# EAGLE design satellitev2 (EAGLE 6.4)
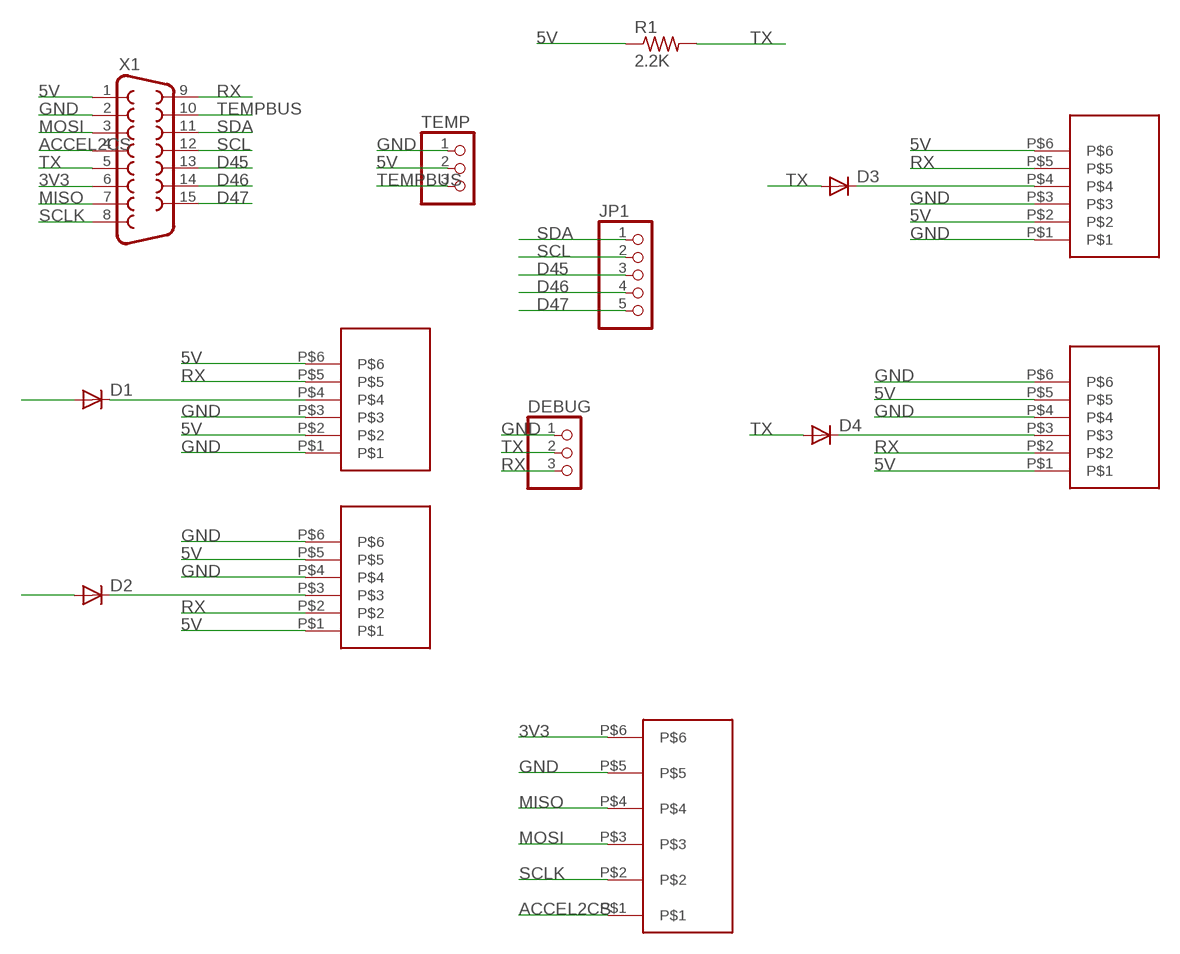
[diagram p0: schematic, sheet 1]

## Parts
D1  DIODEPTH  [DIODE-1N4001]
D2  DIODEPTH  [DIODE-1N4001]
D3  DIODEPTH  [DIODE-1N4001]
D4  DIODEPTH  [DIODE-1N4001]
DEBUG  PINHD-1X3  [1X03]
JP1  PINHD-1X5  [1X05]
R1  2.2K  R-US_0309/12  [0309/12]
TEMP  PINHD-1X3  [1X03]
U$1  1X6SMDPINS  [1X6SMDPINS]
U$2  1X6SMDPINS  [1X6SMDPINS]
U$3  1X6SMDPINSB  [1X6SMDPINSB]
U$4  1X6SMDPINSB  [1X6SMDPINSB]
U$5  RJ11V  [RJ11V]
X1  F15HDV  [HDF15V]

## Nets
3V3: U$5.P$6 X1.6
5V: R1.1 TEMP.2 U$1.P$2 U$1.P$6 U$2.P$1 U$2.P$5 U$3.P$2 U$3.P$6 U$4.P$1 U$4.P$5 X1.1
ACCEL2CS: U$5.P$1 X1.4
D45: JP1.3 X1.13
D46: JP1.4 X1.14
D47: JP1.5 X1.15
GND: DEBUG.1 TEMP.1 U$1.P$1 U$1.P$3 U$2.P$4 U$2.P$6 U$3.P$1 U$3.P$3 U$4.P$4 U$4.P$6 U$5.P$5 X1.2
MISO: U$5.P$4 X1.7
MOSI: U$5.P$3 X1.3
N$1: D2.C U$2.P$3
N$2: D1.C U$1.P$4
N$3: D4.C U$4.P$3
N$4: D3.C U$3.P$4
RX: DEBUG.3 U$1.P$5 U$2.P$2 U$3.P$5 U$4.P$2 X1.9
SCL: JP1.2 X1.12
SCLK: U$5.P$2 X1.8
SDA: JP1.1 X1.11
TEMPBUS: TEMP.3 X1.10
TX: D1.A D2.A D3.A D4.A DEBUG.2 R1.2 X1.5

## Library data of the parts
D1-D4 = SparkFun-DiscreteSemi:DIODE: Diode These are standard reverse protection diodes and small signal diodes. SMA package can handle up to about 1A. SOD-323 can handle about 200mA. What the SOD-323 package when ordering, there are some mfgs out there that are 5-pin packages.
DEBUG TEMP = pinhead:PINHD-1X3: PIN HEADER
JP1 = pinhead:PINHD-1X5: PIN HEADER
R1 = rcl:R-US_: RESISTOR, American symbol
U$1 U$2 = 1x6smdpins:1X6SMDPINS
U$3 U$4 = 1x6smdpins:1X6SMDPINSB
U$5 = RJ11V:RJ11V
X1 = con-subd:F15: SUB-D; OC_FARNELL: unknown; OC_NEWARK: unknown

## Board
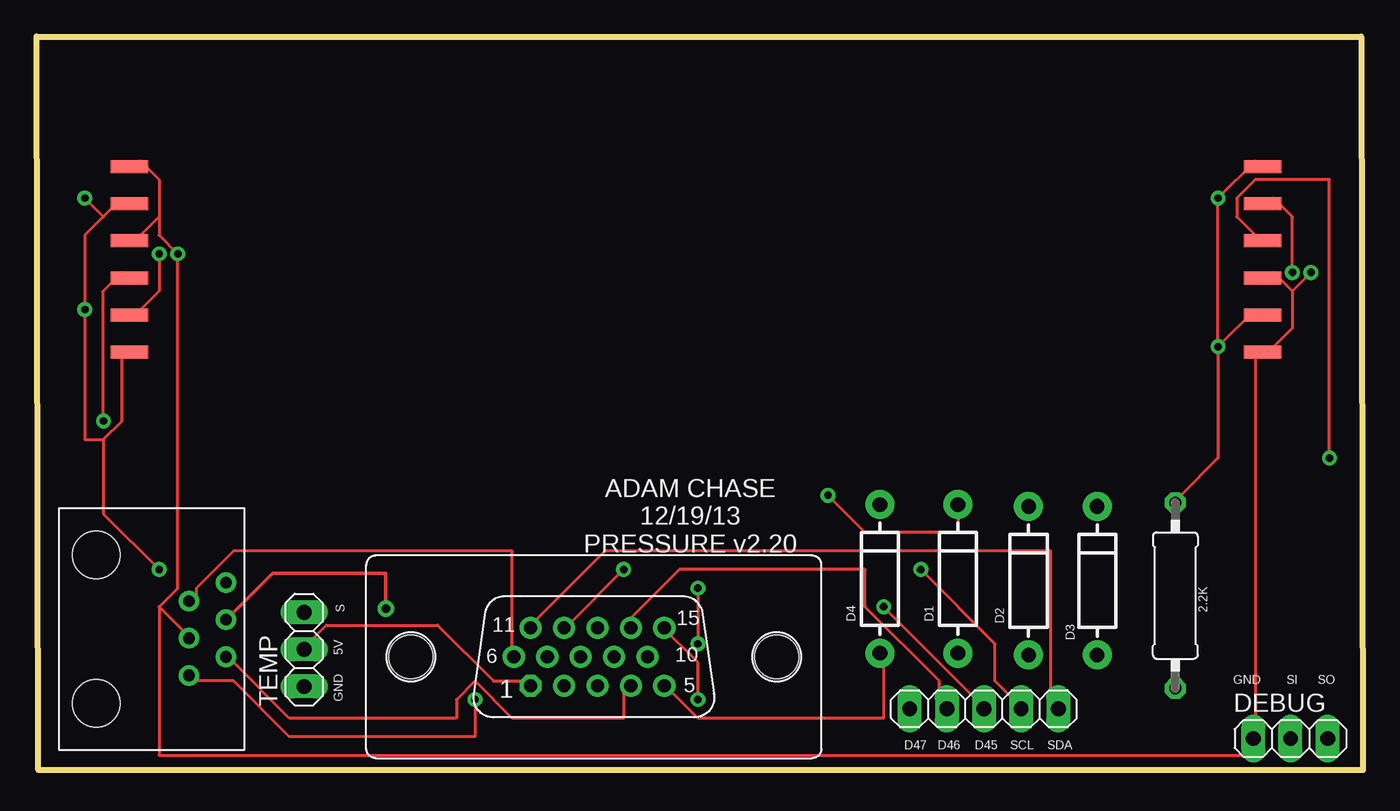
[diagram p1: board, top side]
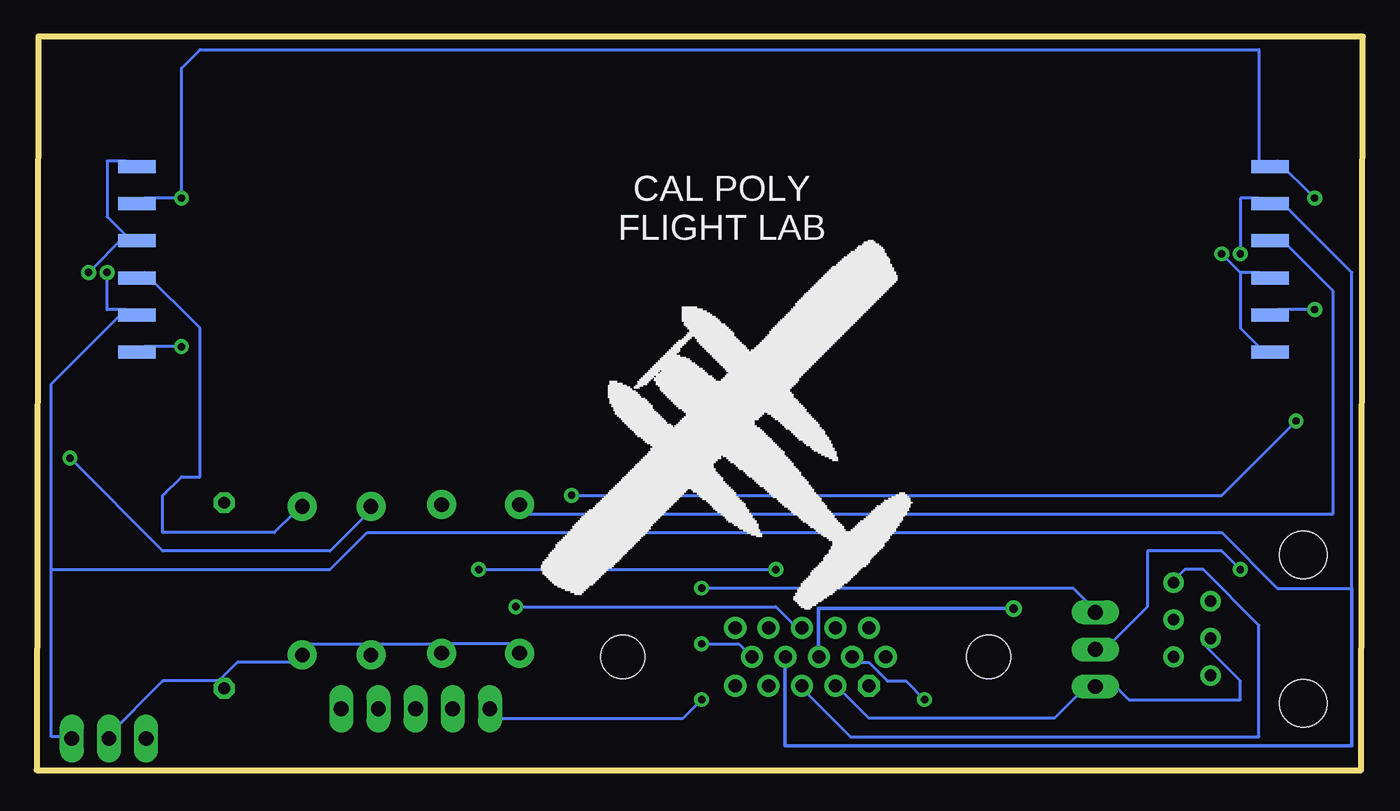
[diagram p2: board, bottom side, seen from below]

Size 90.68 x 50.17 mm. Coordinates in mm from the lower left corner, seen from the top.
Outline: 0.13,0 0,50.17 90.55,50.17 90.68,0 0.13,0
Copper layers (1*16): Top 0.035mm / dielectric 1.5mm / Bottom 0.035mm
Design rules "default": minimum track width 8mil, minimum drill 20mil, track to track 8mil, track to pad 8mil, pad to pad 8mil, via to via 8mil, smd to smd 8mil, copper to edge 10mil, drill to drill 8mil, minimum pad ring 12mil, minimum via ring 10mil, stop-mask expansion 4mil, vias tented up to drill 25mil, thermal gap 10mil
tRestrict: area 10.2,19.7 to 41.9,48.9; area 47,19.7 to 78.7,48.9
bRestrict: area 10.2,19.7 to 41.9,48.9; area 47,19.7 to 78.7,48.9

### Footprints (pad centres in the part's own frame; a part is rotated, then mirrored left to right if it is on the bottom)
DIODE-1N4001 = drill 1 pad 1.981: A -5.08,0; C 5.08,0
1X03 = drill 1.016 long: 1 -2.54,0; 2 0,0; 3 2.54,0
1X05 = drill 1.016 long: 1 -5.08,0; 2 -2.54,0; 3 0,0; 4 2.54,0; 5 5.08,0
0309/12 = drill 0.813 octagon: 1 -6.35,0; 2 6.35,0
1X6SMDPINS = smd 0.889 x 2.54: P$1 0,0; P$2 2.54,0; P$3 5.08,0; P$4 7.62,0; P$5 10.16,0; P$6 12.7,0
1X6SMDPINSB = smd 0.889 x 2.54 bottom: P$1 0,1.27; P$2 2.54,1.27; P$3 5.08,1.27; P$4 7.62,1.27; P$5 10.16,1.27; P$6 12.7,1.27
RJ11V = drill 0.8: P$1 6.35,1.27; P$2 8.89,1.27; P$3 11.43,1.27; P$4 5.08,3.81; P$5 7.62,3.81; P$6 10.16,3.81 | hole 3.25: 3.175,10.16; 13.335,10.16
HDF15V = drill 0.9 octagon: 1 4.329,1.98 | drill 0.9: 2 2.043,1.98; 3 -0.243,1.98; 4 -2.529,1.98; 5 -4.815,1.98; 6 5.472,0; 7 3.186,0; 8 0.9,0; 9 -1.386,0; 10 -3.672,0; 11 4.329,-1.98; 12 2.043,-1.98; 13 -0.243,-1.98; 14 -2.529,-1.98; 15 -4.815,-1.98 | hole 3: -12.5,0; 12.5,0

### Placement (x,y rotation side)
D1  62.99,13.08 90 top
D2  67.82,12.95 90 top
D3  72.52,12.95 90 top
D4  57.66,13.08 90 top
DEBUG  85.72,2.16 0 top
JP1  64.77,4.19 180 top
R1  77.85,11.94 270 top
TEMP  18.29,8.25 90 top
U$1  6.35,41.28 270 top
U$2  83.82,41.28 270 top
U$3  82.55,41.28 270 top
U$4  5.08,41.28 270 top
U$5  14.22,1.4 90 top
X1  38.1,7.75 180 top

### Tracks (layer width: path | path; a pad name or v marks a point on that pad's centre or on a via)
3V3
  Top 0.203: U$5.P$6 10.92,11.18 10.92,12.45 13.46,14.99 32.51,14.99 32.51,7.37 X1.6
5V  (via drill 0.51)
  Top 0.203: X1.1 33.78,6.1 31.24,6.1 27.43,9.91 19.81,9.91 18.54,8.64 TEMP.2 | 4.57,22.61 5.84,23.88 5.84,28.96 U$1.P$6 | 4.57,22.61 3.3,22.61 v3.3,31.5 3.3,36.58 4.57,37.85 | 4.57,37.85 5.84,39.12 U$1.P$2 | 4.57,37.85 v3.3,39.12 | U$2.P$1 83.31,41.66 v80.77,39.12 v80.77,28.96 | v80.77,28.96 83.31,31.5 U$2.P$5 | v80.77,28.96 80.77,21.34 78.23,18.8 R1.1 | v8.38,13.72 4.57,17.53 4.57,22.61
  Bottom 0.203: v3.3,31.5 5.84,31.5 U$4.P$5 | v3.3,39.12 5.84,41.66 U$4.P$1 7.11,41.66 7.11,49.28 79.5,49.28 80.77,48.01 v80.77,39.12 83.31,39.12 U$3.P$2 | v80.77,28.96 83.31,28.96 U$3.P$6 | v8.38,13.72 9.65,14.99 14.73,14.99 14.73,11.18 17.27,8.64 TEMP.2
ACCEL2CS
  Top 0.203: U$5.P$1 13.46,7.37 17.27,3.56 28.7,3.56 28.7,4.83 29.97,6.1 32.51,3.56 40.13,3.56 40.13,6.1 X1.4
D45  (via drill 0.51)
  Top 0.203: v57.91,11.18 64.26,4.83 JP1.3
  Bottom 0.203: v57.91,11.18 40.13,11.18 38.86,9.91 X1.13
D46
  Top 0.203: X1.14 40.13,9.91 43.94,13.72 56.64,13.72 56.64,11.18 61.72,6.1 61.72,4.83 JP1.4
D47  (via drill 0.51)
  Top 0.203: v45.21,4.83 45.21,7.37 42.67,9.91 X1.15
  Bottom 0.203: v45.21,4.83 46.48,3.56 59.18,3.56 JP1.5
GND  (via drill 0.51)
  Top 0.203: 85.85,32.77 85.85,30.23 84.58,28.96 U$2.P$6 83.31,28.96 83.31,2.29 DEBUG.1 83.31,1.02 8.38,1.02 8.38,11.18 | 85.85,32.77 84.58,34.04 U$2.P$4 | 85.85,32.77 v87.12,34.04 | 8.38,37.85 7.11,36.58 U$1.P$3 | 8.38,37.85 8.38,40.39 7.11,41.66 U$1.P$1 | 8.38,37.85 8.38,36.58 v9.65,35.31 9.65,12.45 8.38,11.18 | 8.38,11.18 10.92,8.64 U$5.P$5
  Bottom 0.203: 84.58,36.58 85.85,37.85 85.85,41.66 84.58,41.66 U$3.P$1 | v87.12,34.04 84.58,36.58 | 84.58,36.58 U$3.P$3 | 8.38,34.04 8.38,30.23 7.11,28.96 U$4.P$6 | 8.38,34.04 7.11,34.04 U$4.P$4 | v9.65,35.31 8.38,34.04 | U$5.P$5 10.92,8.64 8.38,6.1 8.38,4.83 16,4.83 17.27,6.1 TEMP.1 18.54,6.1 21.08,3.56 33.78,3.56 36.32,6.1 X1.2
MISO  (via drill 0.51)
  Top 0.203: v29.97,4.83 29.97,2.29 17.27,2.29 13.46,6.1 10.92,6.1 U$5.P$4
  Bottom 0.203: v29.97,4.83 31.24,6.1 32.51,6.1 33.78,7.37 35.05,7.37 X1.7
MOSI
  Bottom 0.203: U$5.P$3 13.46,12.45 12.19,13.72 10.92,13.72 7.11,9.91 7.11,2.29 35.05,2.29 38.86,6.1 X1.3
N$1  (via drill 0.51)
  Top 0.203: v88.39,21.34 88.39,40.39 83.31,40.39 82.04,39.12 82.04,37.85 83.31,36.58 U$2.P$3
  Bottom 0.203: v88.39,21.34 82.04,14.99 70.61,14.99 68.07,17.53 D2.C
N$2  (via drill 0.51)
  Top 0.203: v4.57,23.88 4.57,32.77 5.84,34.04 U$1.P$4 | v54.1,18.8 56.64,16.26 62.99,16.26 D1.C
  Bottom 0.203: v4.57,23.88 9.65,18.8 v54.1,18.8
N$3
  Bottom 0.203: U$4.P$3 5.84,36.58 2.03,32.77 2.03,17.53 57.91,17.53 D4.C
N$4
  Bottom 0.203: U$3.P$4 83.31,34.04 79.5,30.23 79.5,20.07 80.77,20.07 82.04,18.8 82.04,16.26 74.42,16.26 73.15,17.53 D3.C
RX  (via drill 0.51)
  Top 0.203: v8.38,35.31 8.38,32.77 7.11,31.5 U$1.P$5 | v85.85,34.04 85.85,37.85 84.58,39.12 U$2.P$2
  Bottom 0.203: v8.38,35.31 8.38,39.12 7.11,39.12 U$4.P$2 5.84,39.12 0.76,34.04 0.76,12.45 5.84,12.45 9.65,16.26 68.07,16.26 70.61,13.72 89.66,13.72 | 84.58,31.5 89.66,26.42 89.66,13.72 | 89.66,13.72 89.66,2.29 88.39,2.29 DEBUG.3 | v85.85,34.04 85.85,31.5 84.58,31.5 | 84.58,31.5 U$3.P$5
  Bottom 0.254: X1.9 39.5,7.75 39.5,1.65 0.76,1.65 0.76,12.45
SCL  (via drill 0.51)
  Top 0.203: v40.13,13.72 36.32,9.91 X1.12 | v60.45,13.72 65.53,8.64 65.53,6.1 66.8,4.83 JP1.2
  Bottom 0.203: v60.45,13.72 v40.13,13.72
SCLK  (via drill 0.6)
  Top 0.254: v23.88,11.05 23.88,13.46 16.13,13.46 U$5.P$2
  Bottom 0.254: X1.8 37.21,11.05 v23.88,11.05
SDA
  Top 0.203: X1.11 33.78,9.91 38.86,14.99 69.34,14.99 69.34,4.83 JP1.1
TEMPBUS  (via drill 0.51)
  Top 0.203: v45.21,12.45 v45.21,8.64
  Bottom 0.203: v45.21,8.64 42.67,8.64 41.4,7.37 X1.10 | v45.21,12.45 19.81,12.45 18.54,11.18 TEMP.3
TX
  Top 0.203: X1.5 42.67,6.1 45.21,3.56 57.91,3.56 57.91,7.37 D4.A
  Bottom 0.203: 62.99,8.64 57.91,8.64 D4.A | 78.23,6.1 76.96,7.37 73.15,7.37 D3.A 71.88,8.64 68.07,8.64 | 78.23,6.1 82.04,6.1 85.85,2.29 DEBUG.2 | 78.23,6.1 R1.2 | 68.07,8.64 62.99,8.64 | 62.99,8.64 D1.A | 68.07,8.64 D2.A

### Text on the board
tPlace: ADAM CHASE / 12/19/13 / PRESSURE v2.20 | S | 5V | GND | SI | SO | GND | D47 | D46 | D45 | SCL | SDA
bPlace: CAL POLY / FLIGHT LAB